# Altium project PCB_Project.PrjPcb
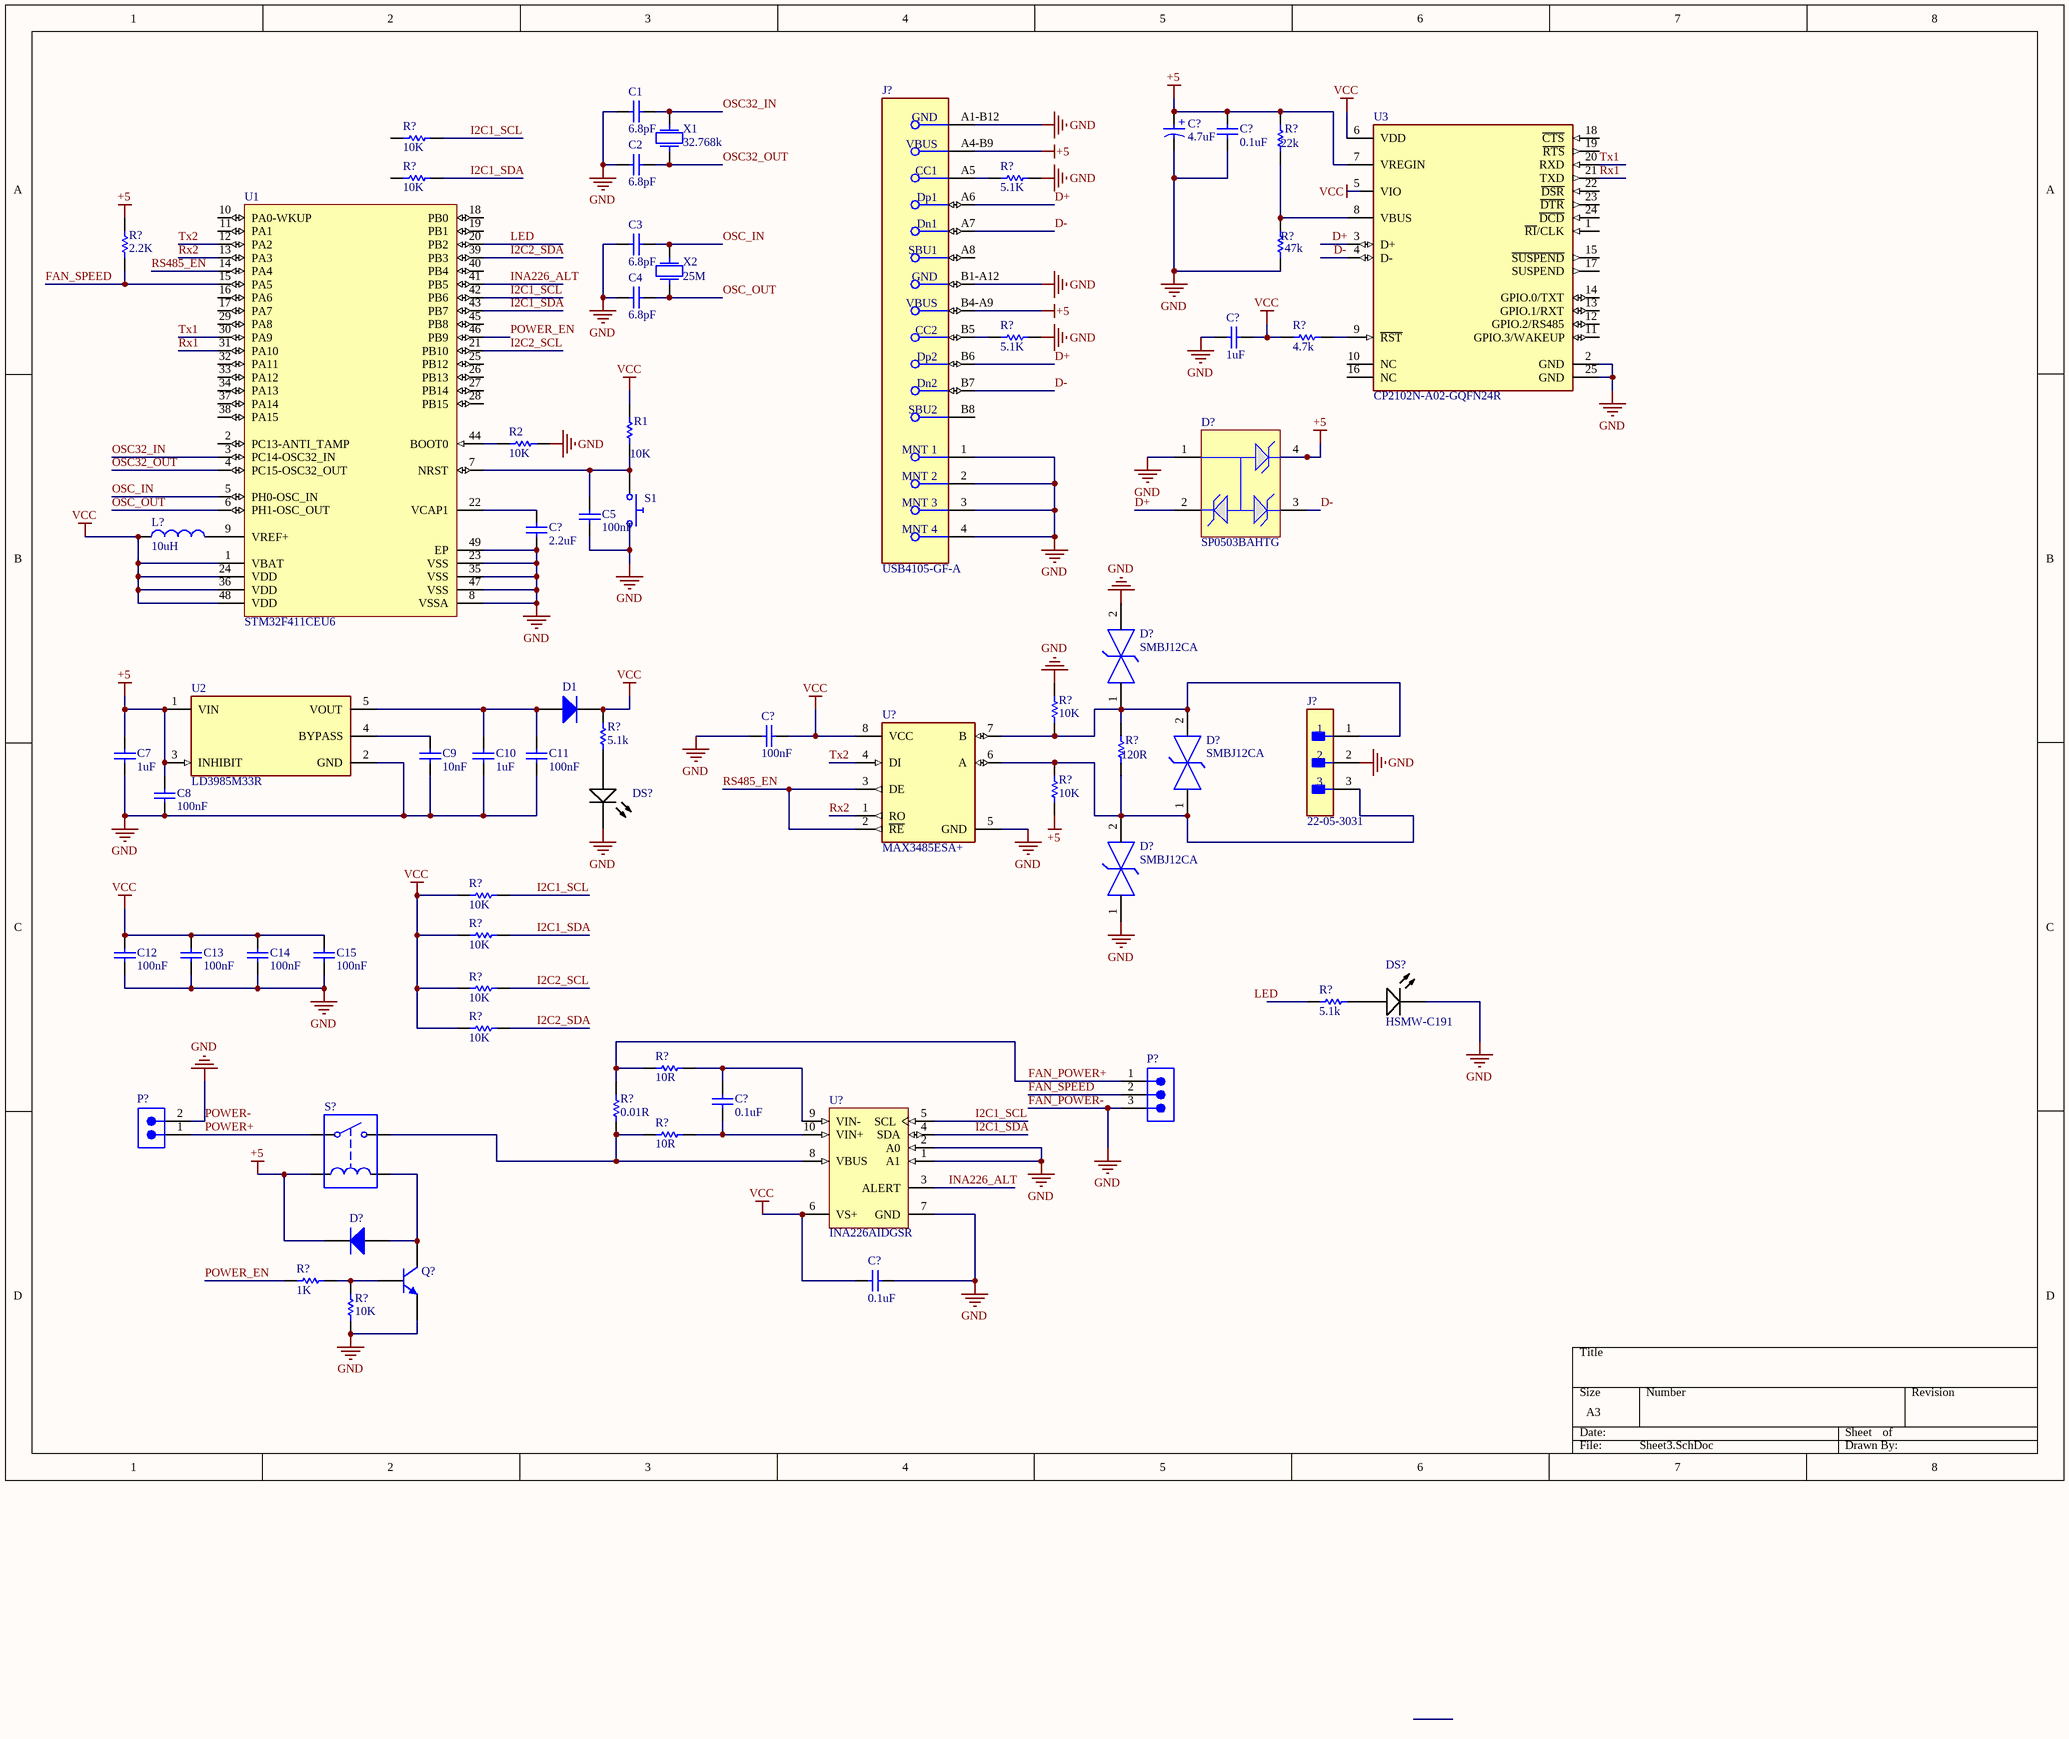
[diagram p0: Sheet3.SchDoc]
2 sheets, 103 parts. Net scope: global (net labels, ports and power ports of the same name join across sheets).
Sheets:
  Sheet3.SchDoc
  Sheet4.SchDoc

## Sheet Sheet3.SchDoc
size A3; SheetNumber: 1; SheetTotal: 2

### Parts
(Parts that share a designator on the sheet are numbered #1, #2 ... from top to bottom, then left to right.)
C1  value 6.8pF  (hidden comment: Capacitor)
C2  value 6.8pF  (hidden comment: Capacitor)
C3  value 6.8pF  (hidden comment: Capacitor)
C4  value 6.8pF  (hidden comment: Capacitor)
C5  value 100nF  (hidden comment: Capacitor)
C7  value 1uF  (hidden comment: Capacitor)
C8  value 100nF  (hidden comment: Capacitor)
C9  value 10nF  (hidden comment: Capacitor)
C10  value 1uF  (hidden comment: Capacitor)
C11  value 100nF  (hidden comment: Capacitor)
C12  value 100nF  (hidden comment: Capacitor)
C13  value 100nF  (hidden comment: Capacitor)
C14  value 100nF  (hidden comment: Capacitor)
C15  value 100nF  (hidden comment: Capacitor)
C?#1  4.7uF  [WCAP-PT5H_D10H12.5]
C?#2  value 0.1uF  (hidden comment: Capacitor)
C?#3  value 1uF  (hidden comment: Capacitor)
C?#4  value 2.2uF  (hidden comment: Capacitor)
C?#5  value 100nF  (hidden comment: Capacitor)
C?#6  value 0.1uF  (hidden comment: Capacitor)
C?#7  value 0.1uF  (hidden comment: Capacitor)
D1  Diode  (value not drawn)
D?#1  SP0503BAHTG  [LFUS-SOT143-4_V]
D?#2  SMBJ12CA  [FP-SMBJ-MFG]
D?#3  SMBJ12CA  [FP-SMBJ-MFG]
D?#4  SMBJ12CA  [FP-SMBJ-MFG]
D?#5  Diode  (value not drawn)
DS?#1  (no value)  [AVAG-HSMW-C191_V]
DS?#2  HSMW-C191  [AVAG-HSMW-C191_V]
J?#1  USB4105-GF-A  [FP-USB4105-GF-A-MFG]
J?#2  22-05-3031  [FP-22-05-3031-MFG]
L?  value 10uH  (hidden comment: Inductor)
P?#1  (no value)  [648103131822]
P?#2  (no value)  [620302124022]
Q?  Bipolar NPN 3 Pins Transistor Gummel-Poon Model  (value not drawn)
R1  value 10K  (hidden comment: Resistor)
R2  value 10K  (hidden comment: Resistor)
R?#1  value 10K  (hidden comment: Resistor)
R?#2  value 22k  (hidden comment: Resistor)
R?#3  value 10K  (hidden comment: Resistor)
R?#4  value 5.1K  (hidden comment: Resistor)
R?#5  value 2.2K  (hidden comment: Resistor)
R?#6  value 47k  (hidden comment: Resistor)
R?#7  value 5.1K  (hidden comment: Resistor)
R?#8  value 4.7k  (hidden comment: Resistor)
R?#9  value 10K  (hidden comment: Resistor)
R?#10  value 5.1k  (hidden comment: Resistor)
R?#11  value 120R  (hidden comment: Resistor)
R?#12  value 10K  (hidden comment: Resistor)
R?#13  value 10K  (hidden comment: Resistor)
R?#14  value 10K  (hidden comment: Resistor)
R?#15  value 10K  (hidden comment: Resistor)
R?#16  value 5.1k  (hidden comment: Resistor)
R?#17  value 10K  (hidden comment: Resistor)
R?#18  value 10R  (hidden comment: Resistor)
R?#19  value 0.01R  (hidden comment: Resistor)
R?#20  value 10R  (hidden comment: Resistor)
R?#21  value 1K  (hidden comment: Resistor)
R?#22  value 10K  (hidden comment: Resistor)
S1  Push Button Normally Opened  (value not drawn)
S?  Single-Pole, Single-Throw Normally Opened Relay  (value not drawn)
U1  STM32F411CEU6  [STM-UFQFPN48_L]
U2  LD3985M33R  [FP-SOT23-5L-7049676-MFG]
U3  CP2102N-A02-GQFN24R  [FP-CP2102N-A02-GQFN24R-MFG]
U?#1  MAX3485ESA+  [FP-S8-5-MFG]
U?#2  INA226AIDGSR  [DGS0010A_L]
X1  F0: 32.768k  (hidden comment: Crystal)
X2  F0: 25M  (hidden comment: Crystal)

### Nets
+5: C7.2 C8.2 C?#1.1(P) C?#2.1 D?#1.4 D?#5.2(K) J?#1.A4-B9(VBUS) J?#1.B4-A9(VBUS) R?#2.2 R?#5.2 R?#12.1 S?.3 U2.1(VIN) U2.3(INHIBIT) U3.7(VREGIN)
FAN_POWER-: C1.1 C2.1 C3.1 C4.1 C5.1 C7.1 C8.1 C9.1 C10.1 C11.1 C12.1 C13.1 C14.1 C15.1 C?#1.2(N) C?#2.2 C?#3.2 C?#4.1 C?#5.2 C?#7.1 D?#1.1 D?#2.2 D?#4.1 DS?#1.2(K) DS?#2.2(K) J?#1.1(MNT_1) J?#1.2(MNT_2) J?#1.3(MNT_3) J?#1.4(MNT_4) J?#1.A1-B12(GND) J?#1.B1-A12(GND) J?#2.2 P?#1.3 P?#2.2 Q?.3(E) R2.2 R?#4.2 R?#6.1 R?#7.2 R?#9.2 R?#22.1 S1.2 U1.8(VSSA) U1.23(VSS) U1.35(VSS) U1.47(VSS) U1.49(EP) U2.2(GND) U3.2(GND) U3.25(GND) U?#1.5(GND) U?#2.1(A1) U?#2.2(A0) U?#2.7(GND)  [also labelled GND, POWER-]
VCC: C12.2 C13.2 C14.2 C15.2 C?#3.1 C?#5.1 C?#7.2 D1.2(K) L?.1 R1.2 R?#8.1 R?#10.2 R?#13.2 R?#14.2 R?#15.2 R?#17.2 U1.1(VBAT) U1.24(VDD) U1.36(VDD) U1.48(VDD) U3.5(VIO) U3.6(VDD) U?#1.8(VCC) U?#2.6(VS+)
D+: D?#1.2 J?#1.A6(Dp1) J?#1.B6(Dp2) U3.3(D+)
D-: D?#1.3 J?#1.A7(Dn1) J?#1.B7(Dn2) U3.4(D-)
FAN_POWER+: P?#1.1 R?#18.2 R?#19.1
FAN_SPEED: P?#1.2 R?#5.1 U1.15(PA5)
I2C1_SCL: R?#1.1 R?#13.1 U1.42(PB6) U?#2.5(SCL)
I2C1_SDA: R?#3.1 R?#14.1 U1.43(PB7) U?#2.4(SDA)
I2C2_SCL: R?#15.1 U1.21(PB10)
I2C2_SDA: R?#17.1 U1.39(PB3)
INA226_ALT: U1.41(PB5) U?#2.3(ALERT)
LED: U1.20(PB2)
OSC32_IN: C1.2 U1.3(PC14-OSC32_IN) X1.2
OSC32_OUT: C2.2 U1.4(PC15-OSC32_OUT) X1.1
OSC_IN: C3.2 U1.5(PH0-OSC_IN) X2.2
OSC_OUT: C4.2 U1.6(PH1-OSC_OUT) X2.1
POWER+: P?#2.1 S?.1
POWER_EN: R?#21.1 U1.46(PB9)
RS485_EN: U1.14(PA4) U?#1.2(~{RE}) U?#1.3(DE)
Rx1: U1.31(PA10) U3.21(TXD)
Rx2: U1.13(PA3) U?#1.1(RO)
Tx1: U1.30(PA9) U3.20(RXD)
Tx2: U1.12(PA2) U?#1.4(DI)
NetC5_2: C5.2 R1.1 S1.1 U1.7(NRST)
NetC9_2: C9.2 U2.4(BYPASS)
NetC10_2: C10.2 C11.2 D1.1(A) U2.5(VOUT)
NetC?#4_2: C?#4.2 U1.22(VCAP1)
NetC?#6_1: C?#6.1 R?#20.1 U?#2.10(VIN+)
NetC?#6_2: C?#6.2 R?#18.1 U?#2.9(VIN-)
NetD?#2_1: D?#2.1 D?#3.2 J?#2.1 R?#9.1 R?#11.2 U?#1.7(B)
NetD?#3_1: D?#3.1 D?#4.2 J?#2.3 R?#11.1 R?#12.2 U?#1.6(A)
NetD?#5_1: D?#5.1(A) Q?.1(C) S?.4
NetDS?#1_1: DS?#1.1(A) R?#10.1
NetDS?#2_1: DS?#2.1(A) R?#16.2
NetJ?#1_A5: J?#1.A5(CC1) R?#4.1
NetJ?#1_B5: J?#1.B5(CC2) R?#7.1
NetL?_2: L?.2 U1.9(VREF+)
NetQ?_2: Q?.2(B) R?#21.2 R?#22.2
NetR2_1: R2.1 U1.44(BOOT0)
NetR?#2_1: R?#2.1 R?#6.2 U3.8(VBUS)
NetR?#8_2: R?#8.2 U3.9(~{RST})
NetR?#19_2: R?#19.2 R?#20.2 S?.2 U?#2.8(VBUS)

Not connected (* = marked no-connect by the designer): J?#1 A8(SBU1) B8(SBU2); R?#1 2; R?#3 2; R?#16 1; U1 2(PC13-ANTI_TAMP) 10(PA0-WKUP) 11(PA1) 16(PA6) 17(PA7) 18(PB0) 19(PB1) 25(PB12) 26(PB13) 27(PB14) 28(PB15) 29(PA8) 32(PA11) 33(PA12) 34(PA13) 37(PA14) 38(PA15) 40(PB4) 45(PB8); U3 1(~{RI}/CLK) 10(NC) 11(GPIO.3/WAKEUP) 12(GPIO.2/RS485) 13(GPIO.1/RXT) 14(GPIO.0/TXT) 15(~{SUSPEND}) 16(NC) 17(SUSPEND) 18(~{CTS}) 19(~{RTS}) 22(~{DSR}) 23(~{DTR}) 24(~{DCD})

### Notes on the sheet
- Labels drawn without touching a wire or pin: LED
- (in symbol CMP-03913-54202637-1) +

### Library data of the parts
C1-C5 C7-C15 C?#2-C?#7 = Capacitor: SimulationGenericComponent: True
C?#1 = CMP-03913-54202637-1: 870235175007 WCAP-PT5H Aluminum Polymer Capacitors; Leakage Current: 756µA; Voltage Rating: 6.3V; Ripple Current: 6.64A; Life (Hours): 5000hours; Pitch: 5mm; Capacitance: 1.2mF; Tolerance: 20%; ESR (Equivalent Series Resistance): 7mΩ; Polarity: Polar; Height - Seated (Max): 13.9954mm; Case/Package: Radial; Min Operating Temperature: -55°C; Lead Pitch: 5.0038mm; Mount: Through Hole; Length: 12.5mm; REACH SVHC: Unknown; Packaging: Tape & Box (TB); Voltage Rating (DC): 6.3V; Max Operating Temperature: 105°C; RoHS: Compliant; NexarPartId: 54202637; Diameter: 10mm
D1 D?#5 = Diode: AF: 1; BV: 0; BV_MAX: 1e99; EG: 1.11; FC: 0.5; IBV: 0.001; ISR: 1e-14; MJSW: 0.33; NTUN: 30; TNOM: 27; XTI: 3; SimulationGenericComponent: True; CJO: 0; CJP: 0; CTA: 0; CTP: 0; FCS: 0.5; FV_MAX: 1e99; IKF: 0; IKR: 0; JSW: 0; JTUN: 0; JTUNSW: 0; KEG: 1; KF: 0; LEVEL: 1; N: 1; NBV: 1; NR: 1; NS: 1; PHP: 1; RS: 0; TCV: 0; TLEV: 0; TLEVC: 0; TM1: 0; TM2: 0; TPB: 0; TPHP: 0; TRS: 0; TRS2: 0; TT: 0; TTT1: 0; TTT2: 0; VJ: 1; XTITUN: 3; IS: 1e-14
D?#1 = CMP-2000-05191-1: TVS Diode Array, 30 pF, 30 KV, -40 to 85 degC, 4-Pin SOT143, RoHS, Tape and Reel; Manufacturer: Littelfuse; Direction Type: Uni-Directional; Product Height (mm): 1.05mm; Leakage Current (Max): 0.1uA; Clamping Voltage (Max): 8V; Reverse Stand-off Voltage: 5.5(Min)V; Configuration: Triple; Working Voltage: 5.5V; Product Length (mm): 3.04mm; Working Voltage (Max): 5.5V(Min); Capacitance Value: 30pF; Rad Hardened: No; Number of Elements: 3; Product Depth (mm): 1.4mm; Operating Temperature Max Deg. C: 85C; Suppressor Type: TVS; Operating Temperature Min Deg. C: -40C; Operating Temp Range: -40Cto85C; Mounting: SurfaceMount; Package / Case: SOT-143; Datasheet Version: Dec-13; Package Type: SOT-143; Packaging: TapeandReel; Pin Count: 3+Tab; Operating Temperature Classification: Industrial; Datasheet URL: https://datasheet.ciiva.com/15143/getdatasheetpartid-116020-15143550.pdf; Manufacturer URL: http://www.littelfuse.com/; Leakage Current: 0.1uA; Mounting Style: SurfaceMount; Clamping Voltage: 8V; Polarity: Uni-Directional
D?#2-D?#4 = CMP-08607-000016-1: TVS DIODE 12V 19.9V DO214AA; Manufacturer: Littelfuse Inc; Breakdown Voltage: 13.3V; Max Junction Temp: +150°C; Direction: Bidirectional; Number Of Channels: 1; Peak Pulse Current: 30.2A; Peak Pulse Power: 600W; ComponentLink2URL: https://www.littelfuse.com/~/media/electronics/datasheets/tvs_diodes/littelfuse_tvs_diode_smbj_datasheet.pdf.pdf; Category: Diode; Mouser Description: TVS Diodes - Transient Voltage Suppressors 12Vr 600W 30.2A 5% BiDirectional; Manufacturer Part Number: SMBJ12CA; Temperature: -65°C to +150°C; Device Class L2: TVS Diodes; Height: 2.61mm; Automotive: No; RoHS: TRUE; Digikey Description: TVS DIODE 12V 19.9V DO214AA; Device Class L3: unset; Temperature Range Low: -65°C; Octopart: https://octopart.com/smbj12ca-littelfuse-33212; Device Class L1: Circuit Protection; Package: SMBJ; Temperature Range High: +150°C; Reverse Standoff Voltage: 12V; Clamping Voltage: 19.9V; Lead Free: Yes; ComponentLink2Description: Datasheet
DS?#1 DS?#2 = CMP-007-00016-2: LED Uni-Color White, 78 mW, 20 mA, -40 to 85 degC, 2-Pin SMD, RoHS, Tape and Reel; Manufacturer: Avago; Power: 78mW; Lens Style: Diffused; Luminous Intensity: 200mcd; Forward Voltage: 3.6V; Viewing Angle: 140degrees; Forward Current: 20mA; Illumination Colour: White; Package Quantity: 4000; Mounting Technology: SM; Colour: White; Case/Package: 0603; Package Reference: HSMW-C191; Datasheet Version: May-10; Pins: 2; Package Description: 2-Pin Surface Mount Device, Body 1.6 x 0.8 mm; Min Operating Temperature: -40°C; RoHS Compliant: True; Packaging: TapeandReel; Manufacturer URL: http://www.avagotech.com/; Datasheet URL: http://docs.avagotech.com/docs/AV02-0186EN; Nominal Vf: 3.6V; Max Operating Temperature: 85°C
J?#1 = CMP-245163-000001-1: CONN RCPT USB2.0 TYPEC 5A; Manufacturer: GCT; Voltage Rating: 20V; Is Female: yes; Current Rating: 5/6.25/1.25/0.25A; Number Of Contacts: 16; Conn Orientation: Right Angle; Device Class L1: Connectors; Category: Conn; Lead Free: Yes; RoHS: TRUE; Temperature Range High: +85°C; Digikey Description: CONN RCPT USB2.0 TYPEC 5A; Device Class L3: unset; ComponentLink2Description: Datasheet; Manufacturer Part Number: USB4105-GF-A; Package: 0; Usb Standard: USB 2.0; Device Class L2: USB Connectors; Automotive: No; Temperature Range Low: -40°C; Height: 3.46mm; Temperature: -40°C to +85°C; Contact Material: Gold,Nickel; ComponentLink2URL: https://gct.co/files/drawings/usb4105.pdf; Octopart: https://octopart.com/usb4105-gf-a-gct-106627878
J?#2 = CMP-04776-000253-1: CONN HEADER R/A 3POS 2.54MM; Number of Positions: 3; Max Current Rating: 4A; Contact Resistance: 10mR; Voltage Rating (DC): 250V; Gender: Male; Approvals: UL; Insulation Resistance: 50GR; Glow Wire Compliant: Non-compliant; Contact Plating: Tin; Packaging: Bulk; Color: White; Series: 7478; Package Quantity: 2000; Depth: 12.83mm; Mount: Through Hole; Length: 7.62mm; Fastening Type: Friction; Number of Circuits: 3; Lead Pitch: 2.54mm; Housing Color: White; Contact Type: Male Pin; Lead Free: Lead Free; Flammability Rating: UL94 V-0; Halogen Free: Low Halogen; Termination: Solder; Contact Mating Length: 0.264inch; Radiation Hardening: No; Min Operating Temperature: 0°C; Pitch: 2.54mm; RoHS Compliant: Yes; Orientation: Right Angle; Number of Rows: 1; Height: 6.35mm; Max Operating Temperature: 75°C; Voltage Rating: 250V; Contact Material: Brass; Number of Contacts: 3; Housing Material: Nylon; Current Rating: 4A
L? = Inductor: SimulationGenericComponent: True
P?#1 = CMP-1502-00731-2: NexarPartId: 18818252; Pitch: 1.5mm; Contact Resistance: 20mΩ; Insulation Resistance: 500MΩ; Current Rating: 1A; Operating Supply Voltage: 50V; Number of Contacts: 3; Connector Type: Male Pin; Insulation: Insulated; Gender: Male; Termination: SMD/SMT; Mount: Surface Mount; Max Operating Temperature: 85°C; Width: 7.5mm; REACH SVHC: Unknown; Contact Gender: Male; Color: Beige, White; Number of Pins: 3; Height: 3.7mm; Number of Rows: 1; RoHS: Compliant; Contact Plating: Tin; Contact Material: Copper; Min Operating Temperature: -25°C; Lead Pitch: 1.5mm; Housing Material: Nylon; Packaging: Tape and Reel; Voltage Rating: 50V; Flammability Rating: UL94 V-0; Number of Positions: 3; Length: 7.5mm
P?#2 = CMP-1502-00660-2: NexarPartId: 18818242; Insulation: Insulated; Connector Type: Male Pin; Pitch: 2mm; Insulation Resistance: 1GΩ; Gender: Male; Voltage Rating: 125V; Number of Positions: 2; Contact Resistance: 20mΩ; Operating Supply Voltage: 100V; Current Rating: 2A; Contact Material: Copper; Number of Rows: 1; Flammability Rating: UL94 V-0; Housing Material: Nylon; Lead Pitch: 2mm; Orientation: Vertical; Max Operating Temperature: 85°C; Termination: SMD/SMT; REACH SVHC: Unknown; Contact Mating Length: 3.5052mm; RoHS: Compliant; Packaging: Tape and Reel; Number of Contacts: 2; Height: 6.6mm; Mount: Surface Mount; Number of Pins: 2; Contact Gender: Male; Min Operating Temperature: -40°C; Length: 5mm; Width: 7.9mm; Contact Plating: Tin; Color: Beige, White
Q? = BJT NPN_GP: SimulationGenericComponent: True; BF: 100; AF: 0; BR: 1; EG: 1.11; FC: 0.5; IS: 1e-16; MJC: 0.33; NC: 2; NE: 1.5; TNOM: 27; VBC_MAX: 1e99; VJC: 0.75; XTI: 3; CJC: 0; CJE: 0; CJS: 0; CTC: 0; CTE: 0; CTS: 0; IKF: 0; IKR: 0; IRB: 0; ISC: 0; ISE: 0; ISS: 0; ITF: 0; KF: 0; MJE: 0.33; MJS: 0; NF: 1; NKF: 0.5; NR: 1; NS: 1; PTF: 0; RB: 0; RBM: 0; RC: 0; RE: 0; SUBS: 1; TBF1: 0; TBF2: 0; TBR1: 0; TBR2: 0; TF: 0; TIKF1: 0; TIKF2: 0; TIKR1: 0; TIKR2: 0; TIRB1: 0; TIRB2: 0; TIS1: 0; TIS2: 0; TISC1: 0; TISC2: 0; TISE1: 0; TISE2: 0; TITF1: 0; TITF2: 0; TLEV: 0; TLEVC: 0; TMJC1: 0; TMJC2: 0; TMJE1: 0; TMJE2: 0; TMJS1: 0; TMJS2: 0; TNC1: 0; TNC2: 0; TNE1: 0; TNE2: 0; TNF1: 0; TNF2: 0; TNR1: 0; TNR2: 0; TNS1: 0; TNS2: 0; TR: 0; TRB1: 0; TRB2: 0; TRC1: 0; TRC2: 0; TRE1: 0; TRE2: 0; TRM1: 0; TRM2: 0; TTF1: 0; TTF2: 0; TTR1: 0; TTR2: 0; TVAF1: 0; TVAF2: 0; TVAR1: 0; TVAR2: 0; TVJC: 0; TVJE: 0; TVJS: 0; VAF: 0; VAR: 0; VBE_MAX: 1e99; VCE_MAX: 1e99; VJE: 0.75; VJS: 0.75; VTF: 0; XCJC: 1; XTB: 0; XTF: 0
R1 R2 R?#1-R?#22 = Resistor: TC1: 0; SimulationGenericComponent: True; TC2: 0
S1 = Push Button NO: closed: 0; Rclosed: 1m; Ropen: 1Meg; SimulationGenericComponent: True
S? = SPST Relay NO: L_C: 1u; R_C: 100; RON: 1; ROFF: 1e12; ION: 1m; IOFF: 0; SimulationGenericComponent: True
U1 = CMP-0243-00165-1: ARM Cortex-M4 32-bit MCU+FPU, 512 KB Flash, 128 KB RAM, 36 I/Os, 48-Pin UFQFPN, -40 to 85 degC, Tray; Operating Frequency(F) (Processor speed) (MHz): 100; FLASH Size (Prog) (kB): 512; Internal RAM Size (kB): 128; I/Os (High Current): 36; Supply Voltage(Vcc) min (V): 1.7; Package Reference: 48-Pin Ultra Thin Fine Pitch Quad Flat No-Lead, 7 x 7 x 0.6 mm Body, 0.5 mm Pitch, Exposed Pad; ComponentLink1Description: Manufacturer URL; ComponentLink1URL: http://www.st.com/; Packing: Tray; Package Description: UFQFPN48; Core: ARM Cortex-M4; ComponentLink2Description: Datasheet; ComponentLink2URL: http://www.st.com/st-web-ui/static/active/en/resource/technical/document/datasheet/DM00115249.pdf; DatasheetVersion: Rev. 6; Mounting Technology: Surface Mount
U2 = CMP-0244-00328-3: NexarPartId: 526998; Min Output Voltage: 3.3V; Min Input Voltage: 2.5V; Max Junction Temperature (Tj): 125°C; Min Current Limit: 300mA; Input Bias Current: 85µA; Max Supply Voltage: 6V; Quiescent Current: 150µA; Max Output Current: 150mA; Number of Channels: 1; Output Type: Fixed; Output Voltage Accuracy: 2%; Polarity: Positive; Dropout Voltage: 60mV; Width: 1.75mm; Height: 1.3mm; Lifecycle Status: Production; Case/Package: SOT-23; RoHS: Compliant; Output Current: 150mA; Radiation Hardening: No; Number of Regulators: 1; Max Operating Temperature: 125°C; Output Voltage: 3.3V; Min Supply Voltage: 2.5V; Min Operating Temperature: -40°C; Accuracy: 2%; Number of Outputs: 1; Number of Pins: 5; Packaging: Cut Tape (CT); Lead Free: Lead Free; Schedule B: 8542390000, 8542390000; Mount: Surface Mount; Max Input Voltage: 6V; Length: 3mm
U3 = CMP-08107-000009-2: IC USB TO UART BRIDGE QFN24; Manufacturer Lifecycle Status: FULL PRODUCTION; NexarPartId: 99772192; Max Junction Temperature (Tj): 105°C; Min Supply Voltage: 1.71V; Max Supply Voltage: 3.6V; Number of Digital IO: 4; Interface: I2C, RS-485, UART, USB; Lifecycle Status: Production; Min Operating Temperature: -40°C; Height: 800µm; Ambient Temperature Range High: 85°C; Schedule B: 8542390000, 8542390000; Max Operating Temperature: 85°C
U?#1 = CMP-05679-000020-1: IC TXRX RS485/422 10MBPS 8SOIC; Manufacturer: Maxim Integrated; Nominal Supply Current: 0.95-1.1mA; Data Rate: 10Mbits/s; Min Supply Voltage: 3V; Interface: RS-485,RS-422; Number Of Transmitters: 1; Max Supply Voltage: 3.6V; Max Junction Temp: +160°C; Standoff Height: 0.1mm; Simplex Duplex: Half Duplex; Height: 1.75mm; Temperature Range High: +85°C; Device Class L2: Interface ICs; Digikey Description: IC TXRX RS485/422 10MBPS 8SOIC; Temperature: -40°C to +85°C; Device Class L3: RS-232 / RS-422 / RS-485 Interface ICs; Temperature Range Low: -40°C; Footprint Url: https://pdfserv.maximintegrated.com/land_patterns/90-0096.PDF; Category: IC; ComponentLink2URL: https://datasheets.maximintegrated.com/en/ds/MAX3483-MAX3491.pdf; Package: S8-5; Octopart: https://octopart.com/max3485esa%2B-maxim+integrated-39731860; RoHS: TRUE; Manufacturer Part Number: MAX3485ESA+; Lead Free: Yes; ComponentLink2Description: Datasheet; Device Class L1: Integrated Circuits (ICs); Mouser Description: 3.3V Powered, 10Mbps and Slew-Rate Limited, True RS-485/RS-422 Transceivers; Number Of Receivers: 1; Automotive: No
U?#2 = CMP-0704-00058-2: High-Side Measurement, Bi-Directional Current / Power Monitor with I2C Interface, 2.7 to 5.5 V, -40 to 125 degC, 10-pin SOP (DGS10), Green (RoHS & no Sb/Br); Vs(Max)(V): 5.5; CMRR(Min)(dB): 126; Rating: Catalog; Input Offset (+/-)(Max)(uV): 10; Small-Signal Bandwidth(Typ)(MHz): 0.007; Input Offset Drift (+/-)(Max)(uV/Degrees Celsius): 0.1; Common Mode Range(Max)(V): 36; Gain(V/V): 1; SubFamily: Current Shunt Monitor; Quiescent Current (+/-)(Typ)(mA): 0.33; Vs(Min)(V): 2.7; Common Mode Range(Min)(V): 0; ComponentLink2URL: http://www.ti.com/general/docs/lit/getliterature.tsp?genericPartNumber=INA226&fileType=pdf; ComponentLink1URL: http://www.ti.com/; PartNumber: INA226AIDGSR; Mounting Technology: Surface Mount; PackageDescription: 10-Pin Plastic Small Outline, Body 3 x 3 mm, Pitch 0.5 mm; ComponentLink3Description: Package Specification; Code_JEDEC: MO-153; Eco-Plan: Green (RoHS & no Sb/Br); PackageReference: DGS0010A; ComponentLink2Description: Datasheet; ComponentLink3URL: http://www.ti.com/lit/ml/mpds035b/mpds035b.pdf; ComponentLink1Description: Manufacturer URL; DatasheetVersion: SBOS547; PackageVersion: 4073272/C, 02/2004
X1 X2 = Crystal: R: 500; Q: 50K; SimulationGenericComponent: True

## Sheet Sheet4.SchDoc
size A4; SheetNumber: 2; SheetTotal: 2
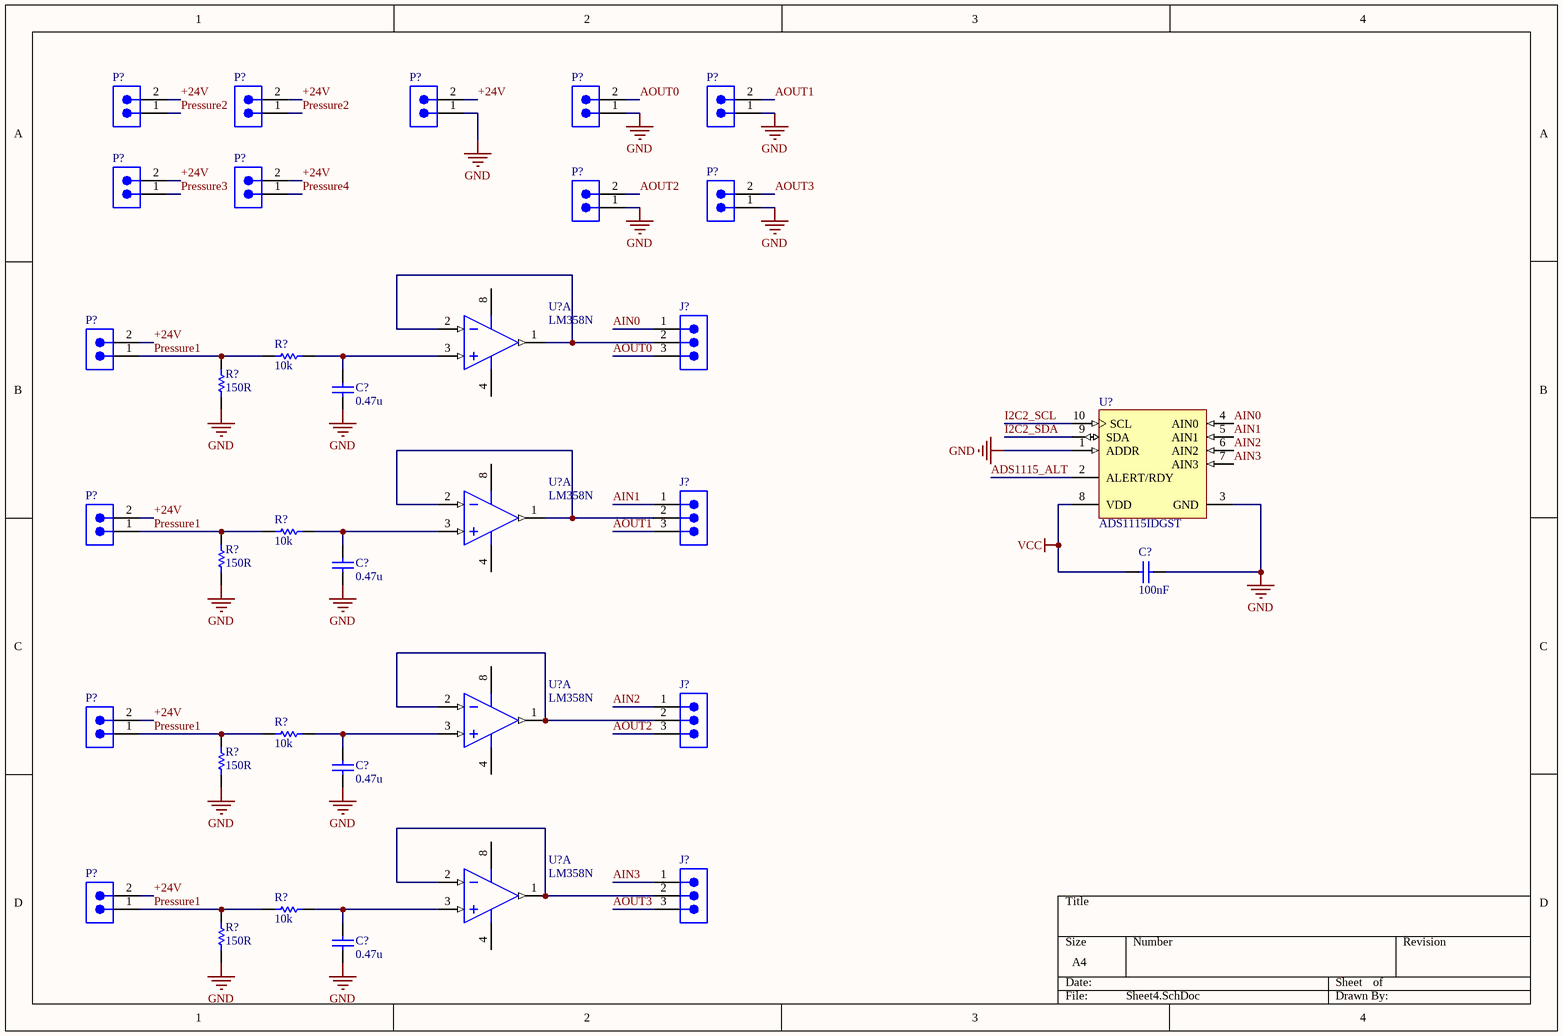
[diagram p1: Sheet4.SchDoc]

### Parts
(Parts that share a designator on the sheet are numbered #1, #2 ... from top to bottom, then left to right.)
C?#8  value 0.47u  (hidden comment: Capacitor)
C?#9  value 100nF  (hidden comment: Capacitor)
C?#10  value 0.47u  (hidden comment: Capacitor)
C?#11  value 0.47u  (hidden comment: Capacitor)
C?#12  value 0.47u  (hidden comment: Capacitor)
J?#3  (no value)  [679303124022]
J?#4  (no value)  [679303124022]
J?#5  (no value)  [679303124022]
J?#6  (no value)  [679303124022]
P?#3  (no value)  [620302124022]
P?#4  (no value)  [620302124022]
P?#5  (no value)  [620302124022]
P?#6  (no value)  [620302124022]
P?#7  (no value)  [620302124022]
P?#8  (no value)  [620302124022]
P?#9  (no value)  [620302124022]
P?#10  (no value)  [620302124022]
P?#11  (no value)  [620302124022]
P?#12  (no value)  [620302124022]
P?#13  (no value)  [620302124022]
P?#14  (no value)  [620302124022]
P?#15  (no value)  [620302124022]
R?#23  value 10k  (hidden comment: Resistor)
R?#24  value 150R  (hidden comment: Resistor)
R?#25  value 10k  (hidden comment: Resistor)
R?#26  value 150R  (hidden comment: Resistor)
R?#27  value 10k  (hidden comment: Resistor)
R?#28  value 150R  (hidden comment: Resistor)
R?#29  value 10k  (hidden comment: Resistor)
R?#30  value 150R  (hidden comment: Resistor)
U?#3  LM358N  [ONSC-PDIP-8-626-05_M]  (part A of 2)
U?#4  ADS1115IDGST  [TI-DGS10_M]
U?#5  LM358N  [ONSC-PDIP-8-626-05_M]  (part A of 2)
U?#6  LM358N  [ONSC-PDIP-8-626-05_M]  (part A of 2)
U?#7  LM358N  [ONSC-PDIP-8-626-05_M]  (part A of 2)

### Nets
GND: C?#8.1 C?#9.1 C?#10.1 C?#11.1 C?#12.1 P?#5.1 P?#6.1 P?#7.1 P?#10.1 P?#11.1 R?#24.1 R?#26.1 R?#28.1 R?#30.1 U?#4.1(ADDR) U?#4.3(GND)  [project net FAN_POWER-]
VCC: C?#9.2 U?#4.8(VDD)
+24V: P?#3.2 P?#4.2 P?#5.2 P?#8.2 P?#9.2 P?#12.2 P?#13.2 P?#14.2 P?#15.2
ADS1115_ALT: U?#4.2(ALERT/RDY)
AIN0: J?#3.1 U?#4.4(AIN0)
AIN1: J?#4.1 U?#4.5(AIN1)
AIN2: J?#5.1 U?#4.6(AIN2)
AIN3: J?#6.1 U?#4.7(AIN3)
AOUT0: J?#3.3 P?#6.2
AOUT1: J?#4.3 P?#7.2
AOUT2: J?#5.3 P?#10.2
AOUT3: J?#6.3 P?#11.2
I2C2_SCL: U?#4.10(SCL)
I2C2_SDA: U?#4.9(SDA)
Pressure1: P?#12.1 P?#13.1 P?#14.1 P?#15.1 R?#23.2 R?#24.2 R?#25.2 R?#26.2 R?#27.2 R?#28.2 R?#29.2 R?#30.2
Pressure2: P?#3.1 P?#4.1
Pressure3: P?#8.1
Pressure4: P?#9.1
NetC?#8_2: C?#8.2 R?#23.1 U?#3.3(INA+)
NetC?#10_2: C?#10.2 R?#25.1 U?#5.3(INA+)
NetC?#11_2: C?#11.2 R?#27.1 U?#6.3(INA+)
NetC?#12_2: C?#12.2 R?#29.1 U?#7.3(INA+)
NetJ?#3_2: J?#3.2 U?#3.1(OUTA) U?#3.2(INA-)
NetJ?#4_2: J?#4.2 U?#5.1(OUTA) U?#5.2(INA-)
NetJ?#5_2: J?#5.2 U?#6.1(OUTA) U?#6.2(INA-)
NetJ?#6_2: J?#6.2 U?#7.1(OUTA) U?#7.2(INA-)

Not connected (* = marked no-connect by the designer): U?#3 4(VEE/GND) 8(VCC); U?#5 4(VEE/GND) 8(VCC); U?#6 4(VEE/GND) 8(VCC); U?#7 4(VEE/GND) 8(VCC)

### Library data of the parts
C?#8-C?#12 = Capacitor: SimulationGenericComponent: True
J?#3-J?#6 = CMP-1502-00722-2: NexarPartId: 18818282; Insulation: Insulated; Operating Supply Voltage: 50V; Number of Contacts: 3; Current Rating: 1A; Insulation Resistance: 100MΩ; Gender: Male; Contact Resistance: 20mΩ; Connector Type: Male Pin; Pitch: 1.5mm; Number of Pins: 3; Flammability Rating: UL94 V-0; Lead Pitch: 1.5mm; Max Operating Temperature: 85°C; Contact Plating: Tin; Contact Gender: Male; Height: 5mm; Contact Material: Copper; Mount: Surface Mount; Termination: SMD/SMT; Number of Positions: 3; Color: Beige, White; Length: 7.5mm; Voltage Rating: 50V; Packaging: Tape and Reel; RoHS: Compliant; Housing Material: Nylon; Width: 7.5mm; Number of Rows: 1; Orientation: Vertical; REACH SVHC: No SVHC; Min Operating Temperature: -25°C
P?#3-P?#15 = CMP-1502-00660-2: as P?#2 on sheet Sheet3; Contact Material: Copper; Number of Rows: 1; Flammability Rating: UL94 V-0; Housing Material: Nylon; Lead Pitch: 2mm; Orientation: Vertical; Max Operating Temperature: 85°C; Termination: SMD/SMT; REACH SVHC: Unknown; Contact Mating Length: 3.5052mm; RoHS: Compliant; Packaging: Tape and Reel; Number of Contacts: 2; Height: 6.6mm; Mount: Surface Mount; Number of Pins: 2; Contact Gender: Male; Min Operating Temperature: -40°C; Length: 5mm; Width: 7.9mm; Contact Plating: Tin; Color: Beige, White
R?#23-R?#30 = Resistor: TC1: 0; SimulationGenericComponent: True; TC2: 0
U?#3 U?#5-U?#7 = CMP-1310-00098-1: Single Supply Dual Operational Amplifier, 3 to 32 V, 0 to 70 degC, 8-Pin PDIP, Tube; Manufacturer: On Semiconductor; VCC Max (V): 32; VCC Min (V): 3; Mounting Technology: Through Hole; ComponentLink3Description: Package Specification; ComponentLink3URL: http://www.onsemi.com/pub_link/Collateral/LM211-D.PDF; RoHS: FALSE; Packing: Tube; PackageDescription: 8-Pin Plastic Dual-In Line Package, Body 9.52 x 6.605 mm, Pitch 2.54 mm; PackageReference: PDIP-8-626-05; PackageVersion: Rev. M, 04/2010; PartNumber: LM358N; ComponentLink2Description: Datasheet; ComponentLink2URL: http://www.onsemi.cn/pub_link/Collateral/LM358-D.PDF; ComponentLink1URL: http://www.onsemi.com/; ComponentLink1Description: Manufacturer URL; DatasheetVersion: Rev. 27
U?#4 = CMP-0003-00378-2: 16-Bit ADC with Integrated Multiplexer, PGA, Comparator, Oscillator, and Reference, -40 to 125 degC, 10-pin SOP (DGS10), Green (RoHS & no Sb/Br); Manufacturer: Texas Instruments; Sample Rate (max)(SPS): 860; SubFamily: Precision ADC (<=10MSPS); Architecture: Delta-Sigma; Digital Supply(Min)(V): 2; Resolution(Bits): 16; Digital Supply(Max)(V): 5.5; INL(Max)(+/-LSB): 1; Interface: Serial I2C; # Input Channels: 4; Eco-Plan: Green (RoHS & no Sb/Br); PackageDescription: 10-Pin Plastic Small Outline, Body 3 x 3 mm, Pitch 0.5 mm; Mounting Technology: Surface Mount; PackageReference: DGS10; DatasheetVersion: SBAS444B; ComponentLink3Description: Package Specification; ComponentLink1Description: Manufacturer URL; PartNumber: ADS1115IDGST; ComponentLink3URL: http://www.ti.com/lit/ml/mpds035b/mpds035b.pdf; ComponentLink2URL: http://www.ti.com/general/docs/lit/getliterature.tsp?genericPartNumber=ADS1115&fileType=pdf; Analog Voltage AV/DD(Min)(V): 2; ComponentLink2Description: Datasheet; PackageVersion: 4073272/C, 02/2004; Analog Voltage AV/DD(Max)(V): 5.5; Code_JEDEC: MO-153; ComponentLink1URL: http://www.ti.com/

## Nets that join several sheets
FAN_POWER-: Sheet3 (54 pins), Sheet4 (16 pins)
VCC: Sheet3 (24 pins), Sheet4 (C?#9.2 U?#4.8)
I2C2_SCL: Sheet3 (R?#15.1 U1.21), Sheet4 (U?#4.10)
I2C2_SDA: Sheet3 (R?#17.1 U1.39), Sheet4 (U?#4.9)